# EAGLE schematic MainSystem v2 (EAGLE 9.7.0)
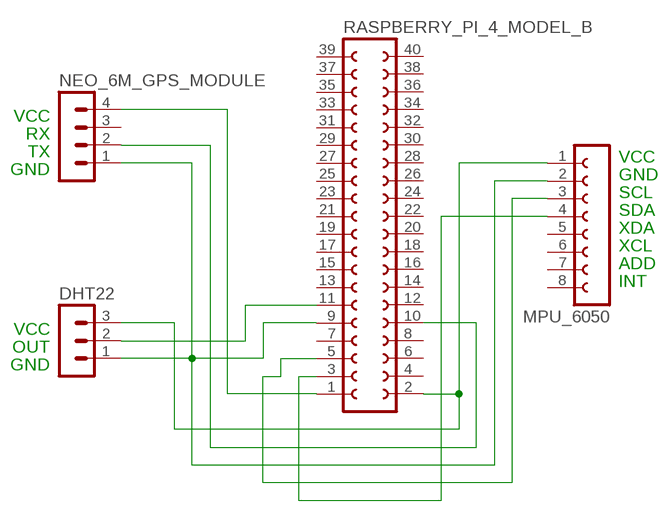
[diagram p0: schematic, sheet 1]

## Parts
DHT22  MA03-1  [MA03-1]
MPU_6050  FE08-1  [FE08]
NEO_6M_GPS_MODULE  MA04-1  [MA04-1]
RASPBERRY_PI_4_MODEL_B  FE20-2  [FE20-2]

## Nets
GND: DHT22.1 MPU_6050.2 NEO_6M_GPS_MODULE.1 RASPBERRY_PI_4_MODEL_B.9
N$1: MPU_6050.3 RASPBERRY_PI_4_MODEL_B.5
N$2: MPU_6050.4 RASPBERRY_PI_4_MODEL_B.3
OUT: DHT22.2 RASPBERRY_PI_4_MODEL_B.11
TX: NEO_6M_GPS_MODULE.2 RASPBERRY_PI_4_MODEL_B.10
VCC: DHT22.3 MPU_6050.1 RASPBERRY_PI_4_MODEL_B.2
VDD: NEO_6M_GPS_MODULE.4 RASPBERRY_PI_4_MODEL_B.1
Unconnected: MPU_6050.5 MPU_6050.6 MPU_6050.7 MPU_6050.8 NEO_6M_GPS_MODULE.3 RASPBERRY_PI_4_MODEL_B.4 RASPBERRY_PI_4_MODEL_B.6 RASPBERRY_PI_4_MODEL_B.7 RASPBERRY_PI_4_MODEL_B.8 RASPBERRY_PI_4_MODEL_B.12 RASPBERRY_PI_4_MODEL_B.13 RASPBERRY_PI_4_MODEL_B.14 RASPBERRY_PI_4_MODEL_B.15 RASPBERRY_PI_4_MODEL_B.16 RASPBERRY_PI_4_MODEL_B.17 RASPBERRY_PI_4_MODEL_B.18 RASPBERRY_PI_4_MODEL_B.19 RASPBERRY_PI_4_MODEL_B.20 RASPBERRY_PI_4_MODEL_B.21 RASPBERRY_PI_4_MODEL_B.22 RASPBERRY_PI_4_MODEL_B.23 RASPBERRY_PI_4_MODEL_B.24 RASPBERRY_PI_4_MODEL_B.25 RASPBERRY_PI_4_MODEL_B.26 RASPBERRY_PI_4_MODEL_B.27 RASPBERRY_PI_4_MODEL_B.28 RASPBERRY_PI_4_MODEL_B.29 RASPBERRY_PI_4_MODEL_B.30 RASPBERRY_PI_4_MODEL_B.31 RASPBERRY_PI_4_MODEL_B.32 RASPBERRY_PI_4_MODEL_B.33 RASPBERRY_PI_4_MODEL_B.34 RASPBERRY_PI_4_MODEL_B.35 RASPBERRY_PI_4_MODEL_B.36 RASPBERRY_PI_4_MODEL_B.37 RASPBERRY_PI_4_MODEL_B.38 RASPBERRY_PI_4_MODEL_B.39 RASPBERRY_PI_4_MODEL_B.40

## Notes on the sheet
- VCC
- RX
- TX
- GND | VCC
- GND
- SCL
- SDA
- XDA
- XCL
- ADD
- INT
- VCC
- OUT
- GND

## Library data of the parts
DHT22 = con-lstb:MA03-1: PIN HEADER; OC_FARNELL: unknown; OC_NEWARK: unknown
MPU_6050 = con-lsta:FE08-1: FEMALE HEADER; OC_FARNELL: unknown; OC_NEWARK: unknown
NEO_6M_GPS_MODULE = con-lstb:MA04-1: PIN HEADER; OC_FARNELL: unknown; OC_NEWARK: unknown
RASPBERRY_PI_4_MODEL_B = con-lsta:FE20-2: FEMALE HEADER; OC_FARNELL: unknown; OC_NEWARK: unknown